# EAGLE design ENC_CON (EAGLE 6.1)
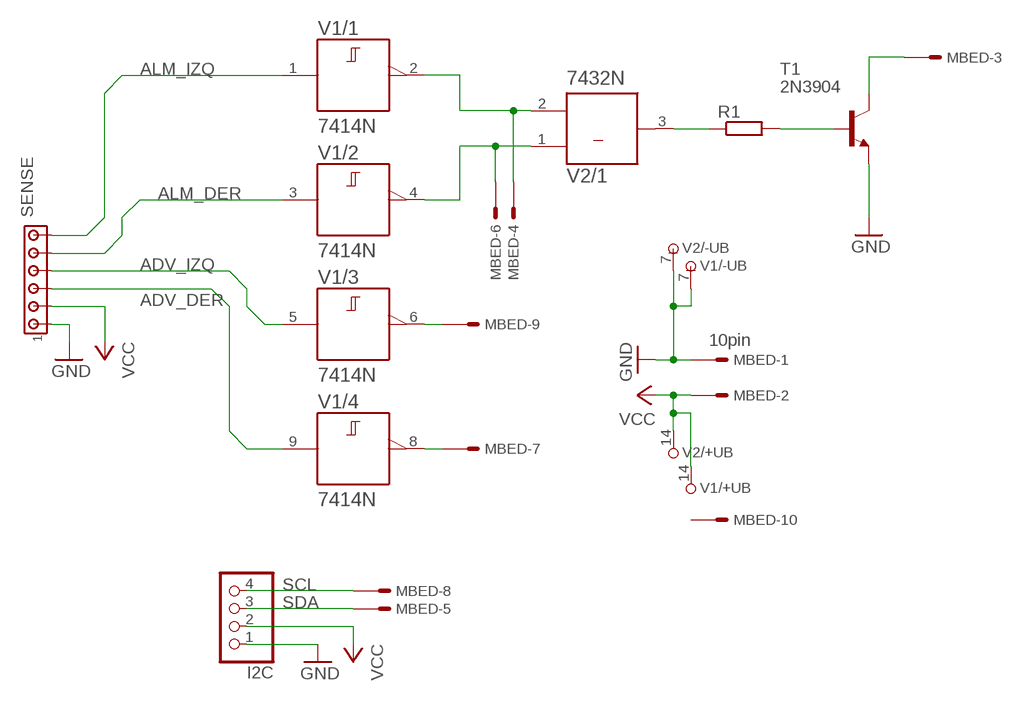
[diagram p0: schematic, sheet 1]

## Parts
I2C  PINHD-1X4/90  [1X04/90]
MBED  10pin  057-010-1  [057-010-1]
R1  R-EU_0207/10  [0207/10]
SENSE  MTA06-100  [10X06MTA]
T1  2N3904  [TO92]
V1  7414N  [DIL14]
V2  7432N  [DIL14]

## Nets
ADV_DER: SENSE.4 V1.9(/4:A)
ADV_IZQ: SENSE.3 V1.5(/3:A)
ALM_DER: SENSE.2 V1.3(/2:A)
ALM_IZQ: SENSE.1 V1.1(/1:A)
GND: I2C.1 MBED.1 SENSE.6 T1.3(E) V1.7(/-UB:-UB) V2.7(/-UB:-UB)
N$1: MBED.9 V1.6(/3:Y)
N$2: MBED.7 V1.8(/4:Y)
N$4: R1.1 V2.3(/1:Y)
N$6: MBED.4 V1.2(/1:Y) V2.2(/1:B)
N$7: MBED.6 V1.4(/2:Y) V2.1(/1:A)
N$9: R1.2 T1.2(B)
N$13: MBED.3 T1.1(C)
SCL: I2C.4 MBED.8
SDA: I2C.3 MBED.5
VCC: I2C.2 MBED.2 SENSE.5 V1.14(/+UB:+UB) V2.14(/+UB:+UB)
Unconnected: MBED.10 V1.10(/5:Y) V1.11(/5:A) V1.12(/6:Y) V1.13(/6:A) V2.4(/2:A) V2.5(/2:B) V2.6(/2:Y) V2.8(/3:Y) V2.9(/3:A) V2.10(/3:B) V2.11(/4:Y) V2.12(/4:A) V2.13(/4:B)

## Library data of the parts
I2C = pinhead:PINHD-1X4: PIN HEADER
MBED = con-panduit:057-010-: CONNECTOR 10-pin series 057 contact pc board low profile headers; OC_FARNELL: unknown; OC_NEWARK: unknown
R1 = rcl:R-EU_: RESISTOR, European symbol
SENSE = con-amp:MTA06-100: AMP connector
T1 = transistor:2N3904: NPN TRANSISTOR
V1 = 74ttl-din:74*14: Hex schmitt trigger INVERTER
V2 = 74ttl-din:74*32: Quad 2-input OR gate

## Board
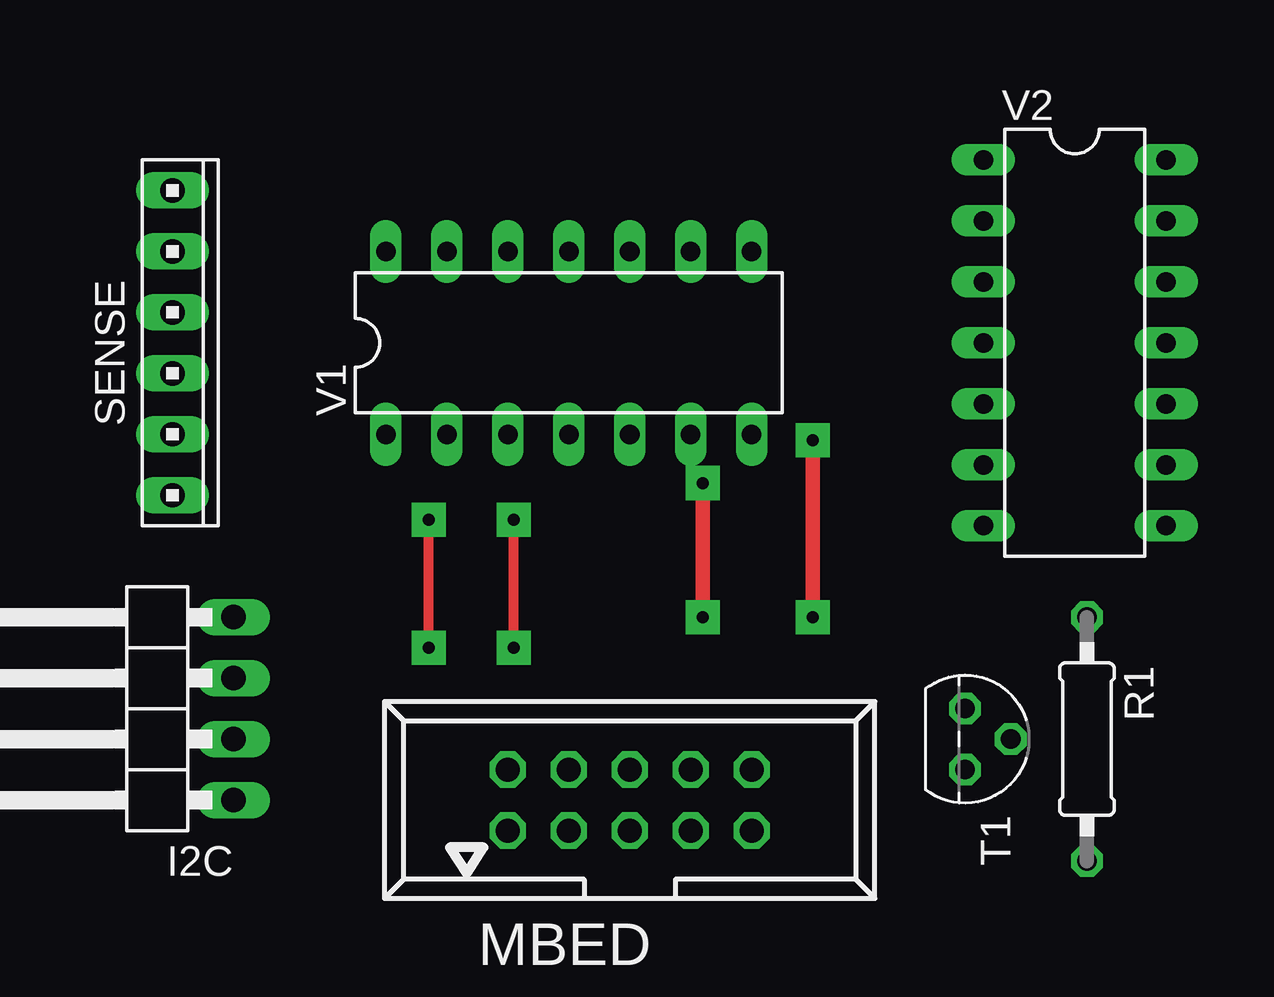
[diagram p1: board, top side]
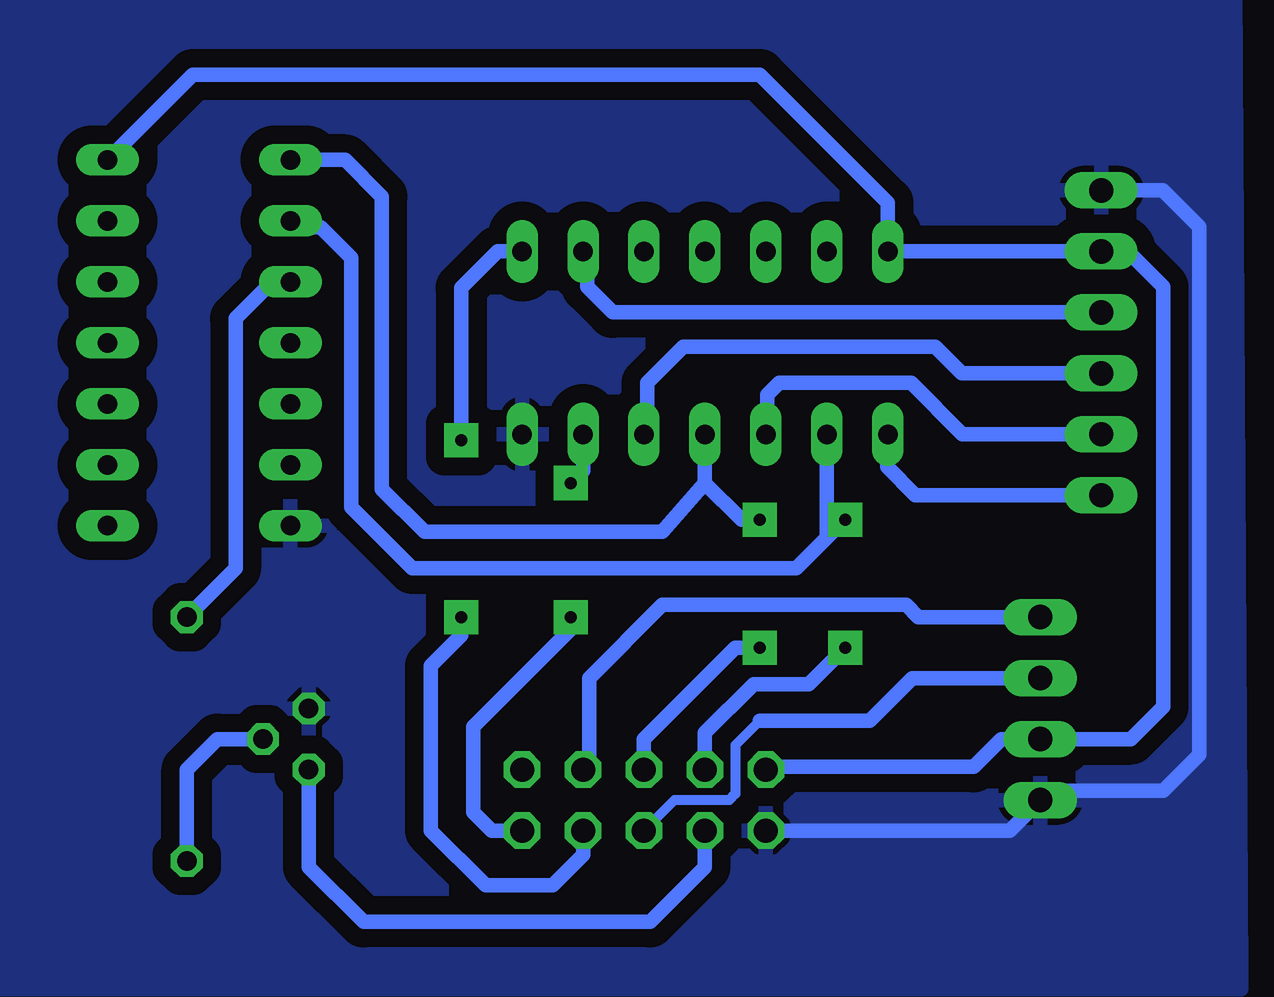
[diagram p2: board, bottom side, seen from below]

No outline drawn. Coordinates in mm, seen from the top.
Copper layers (1*16): Top 0.035mm / dielectric 1.5mm / Bottom 0.035mm
Design rules: minimum track width 10mil, minimum drill 24mil, track to track 30mil, track to pad 30mil, pad to pad 30mil, via to via 30mil, smd to smd 8mil, copper to edge 40mil, drill to drill 8mil, minimum pad ring 10mil, minimum via ring 8mil, stop-mask expansion 4mil, vias tented up to drill 0mil, thermal gap 10mil

### Footprints (pad centres in the part's own frame; a part is rotated, then mirrored left to right if it is on the bottom)
1X04/90 = drill 1.016 long: 1 -3.81,-3.81; 2 -1.27,-3.81; 3 1.27,-3.81; 4 3.81,-3.81
057-010-1 = drill 1 octagon: 1 -5.08,-1.27; 2 -5.08,1.27; 3 -2.54,-1.27; 4 -2.54,1.27; 5 0,-1.27; 6 0,1.27; 7 2.54,-1.27; 8 2.54,1.27; 9 5.08,-1.27; 10 5.08,1.27
0207/10 = drill 0.813 octagon: 1 -5.08,0; 2 5.08,0
10X06MTA = drill 1.016 long: 1 6.35,0; 2 3.81,0; 3 1.27,0; 4 -1.27,0; 5 -3.81,0; 6 -6.35,0
TO92 = drill 0.813 octagon: 1 1.27,0; 2 0,1.905; 3 -1.27,0
DIL14 = drill 0.813 long: 1 -7.62,-3.81; 2 -5.08,-3.81; 3 -2.54,-3.81; 4 0,-3.81; 5 2.54,-3.81; 6 5.08,-3.81; 7 7.62,-3.81; 8 7.62,3.81; 9 5.08,3.81; 10 2.54,3.81; 11 0,3.81; 12 -2.54,3.81; 13 -5.08,3.81; 14 -7.62,3.81

### Placement (x,y rotation side)
I2C  3.81,11.43 90 top
MBED  24.13,7.62 0 top
R1  43.18,10.16 270 top
SENSE  5.08,26.67 270 top
T1  38.1,10.16 270 top
V1  21.59,26.67 0 top
V2  42.67,26.67 270 top

### Tracks (layer width: path | path; a pad name or v marks a point on that pad's centre or on a via)
ADV_DER
  Bottom 0.61: SENSE.4 25.44,27.94 26.5,29 26.5,30.31 V1.9
ADV_IZQ
  Bottom 0.61: SENSE.3 10.9,25.4 12,26.5 22.5,26.5 24,25 24,22.99 V1.5
ALM_DER
  Bottom 0.61: SENSE.2 10.86,22.86 13,25 18.5,25 19,24.5 19,22.91 V1.3
ALM_IZQ
  Bottom 0.61: SENSE.1 12.82,20.32 14,21.5 14,22.83 V1.1
GND
  Bottom 0.61: MBED.1 8.89,6.35 I2C.1 7.24,8 2.5,8 1,9.5 1,31.5 2.52,33.02 SENSE.6
  pour Bottom: -0.76,0.25 -0.51,41.66 52.07,41.66 52.07,-0.25 -0.76,-0.25
N$1  (via drill 0.5 pad 1.42)
  Top 0.61: v27.18,20.83 v27.18,15.24
  Bottom 0.61: V1.6 26.67,21.34 v27.18,20.83 | v27.18,15.24 27.18,14.73 31.24,10.67 31.24,7.11 30.48,6.35 MBED.9
N$2  (via drill 0.5 pad 1.42)
  Top 0.61: v31.75,22.61 v31.75,15.24
  Bottom 0.61: MBED.7 26.67,5.33 27.94,4.06 30.73,4.06 33.02,6.35 33.02,13.21 31.75,14.48 v31.75,15.24 | V1.8 30.23,30.48 31.75,28.96 v31.75,22.61
N$4
  Bottom 0.61: V2.3 39.62,29.21 41.15,27.69 41.15,17.27 R1.1
N$6  (via drill 0.5 pad 1.42)
  Top 0.406: v15.75,13.97 v15.75,19.3
  Bottom 0.61: V1.2 16.51,18.54 | 16.51,18.54 17.78,17.27 33.78,17.27 36.32,19.81 36.32,30.23 37.59,31.5 38.35,31.5 V2.2 | MBED.4 21.59,10.41 19.56,12.45 17.27,12.45 v15.75,13.97 | v15.75,19.3 16.51,18.54
N$7  (via drill 0.5 pad 1.42)
  Top 0.406: v19.3,13.97 v19.3,19.3
  Bottom 0.61: MBED.6 24.13,10.16 20.32,13.97 v19.3,13.97 | v19.3,19.3 20.07,19.3 21.59,20.83 | V1.4 21.59,20.83 | 21.59,20.83 23.37,18.8 33.27,18.8 35.05,20.57 35.05,32.77 36.58,34.29 V2.1
N$9
  Bottom 0.61: R1.2 43.18,8.89 41.91,10.16 T1.2
N$13
  Bottom 0.61: MBED.3 21.59,4.83 23.88,2.54 35.81,2.54 38.1,4.83 T1.1
SCL
  Bottom 0.61: I2C.4 12.7,15.24 13.21,15.75 23.37,15.75 26.42,12.7 26.42,9.14 MBED.8
SDA
  Bottom 0.406: 19.3,10.92 20.32,9.91 20.32,7.87 20.57,7.62 22.86,7.62 MBED.5
  Bottom 0.61: I2C.3 12.95,12.7 14.73,10.92 19.3,10.92
VCC
  Bottom 0.61: MBED.2 18.94,9 10.4,9 9.24,10.16 I2C.2 3.84,10.16 2.5,11.5 2.5,29 4,30.5 5.06,30.5 SENSE.5 V1.14 13.97,32.51 19.3,37.85 42.93,37.85 V2.14